# Altium project qav90.PrjPCB
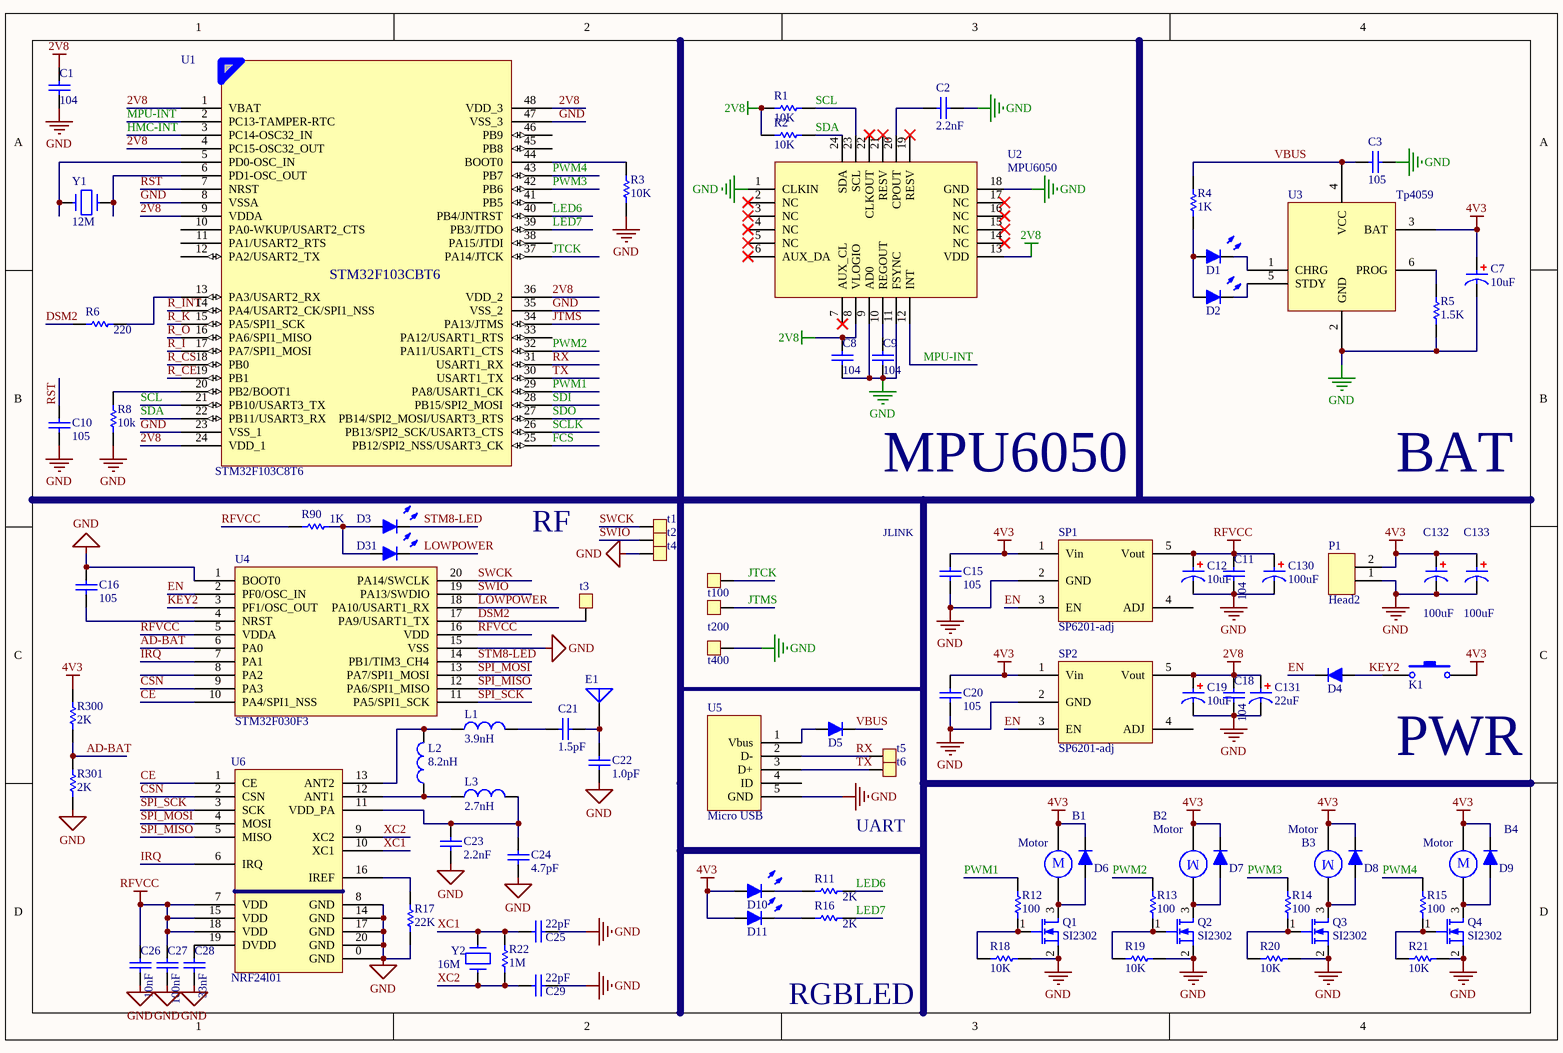
[diagram p0: qav90.SchDoc]
1 sheet, 94 parts. Net scope: global (net labels, ports and power ports of the same name join across sheets).
Board file: qav90.PcbDoc

## Sheet qav90.SchDoc
size A4

### Parts
B1  Motor  [CONN1.27*2]
B2  Motor  [CONN1.27*2]
B3  Motor  [CONN1.27*2]
B4  Motor  [CONN1.27*2]
C1  104  [0603C]
C2  C2.2nF  [0603C]  (value not drawn)
C3  C1uF  [0603C]  (value not drawn)
C7  C10uF  [0603C]  (value not drawn)
C8  104  [0603C]
C9  104  [0603C]
C10  C1uF  [0603C]  (value not drawn)
C11  104  [0603C]
C12  C10uF  [0603C]  (value not drawn)
C15  C1uF  [0603C]  (value not drawn)
C16  C1uF  [0603C]  (value not drawn)
C18  104  [0603C]
C19  C10uF  [0603C]  (value not drawn)
C20  C1uF  [0603C]  (value not drawn)
C21  1.5pF  [0402]
C22  1.0pF  [0402]
C23  2.2nF  [0402]
C24  4.7pF  [0402]
C25  22pF  [0402]
C26  10nF  [0402]
C27  100nF  [0402]
C28  33nF  [0402]
C29  22pF  [0402]
C130  100uF  [1206]
C131  22uF  [0805]
C132  100uF  [1206]
C133  100uF  [1206]
D1  LED-B  [LED]  (value not drawn)
D2  LED-G  [LED]  (value not drawn)
D3  LED-G  [LED]  (value not drawn)
D4  BAT54WS  [LC-SOD-323F]  (value not drawn)
D5  BAT54WS  [LC-SOD-323F]  (value not drawn)
D6  BAT54WS  [LC-SOD-323F]  (value not drawn)
D7  BAT54WS  [LC-SOD-323F]  (value not drawn)
D8  BAT54WS  [LC-SOD-323F]  (value not drawn)
D9  BAT54WS  [LC-SOD-323F]  (value not drawn)
D10  LED-B  [LED]  (value not drawn)
D11  LED-R  [LED]  (value not drawn)
D31  LED-R  [LED]  (value not drawn)
E1  Antenna  [ANT6520]  (value not drawn)
K1  KEY-PB  [KEY_ALPS]  (value not drawn)
L1  3.9nH  [0402]
L2  8.2nH  [0402]
L3  2.7nH  [0402]
P1  Head2  [HEAD2]
Q1  SI2302  [SOT-23-3]
Q2  SI2302  [SOT-23-3]
Q3  SI2302  [SOT-23-3]
Q4  SI2302  [SOT-23-3]
R1  R10K  [0603R]  (value not drawn)
R2  R10K  [0603R]  (value not drawn)
R3  R10K  [0603R]  (value not drawn)
R4  R1K  [0603R]  (value not drawn)
R5  R1.5K  [0603R]  (value not drawn)
R6  R220  [0603R]  (value not drawn)
R8  R10K  [0603R]  (value not drawn)
R11  R2K  [0603R]  (value not drawn)
R12  R100R  [0603R]  (value not drawn)
R13  R100R  [0603R]  (value not drawn)
R14  R100R  [0603R]  (value not drawn)
R15  R100R  [0603R]  (value not drawn)
R16  R2K  [0603R]  (value not drawn)
R17  22K  [0402]
R18  R10K  [0603R]  (value not drawn)
R19  R10K  [0603R]  (value not drawn)
R20  R10K  [0603R]  (value not drawn)
R21  R10K  [0603R]  (value not drawn)
R22  R1M  [0402]  (value not drawn)
R90  R1K  [0603R]  (value not drawn)
R300  R2K  [0603R]  (value not drawn)
R301  R2K  [0603R]  (value not drawn)
SP1  SP6201-adj  [SOT23-5]
SP2  SP6201-adj  [SOT23-5]
t1  TP  [TESTPOINT]  (value not drawn)
t2  TP  [TESTPOINT]  (value not drawn)
t3  TP  [TEST_PAD]  (value not drawn)
t4  TP  [TESTPOINT]  (value not drawn)
t5  TP  [TESTPOINT]  (value not drawn)
t6  TP  [TESTPOINT]  (value not drawn)
t100  TP  [TESTPOINT]  (value not drawn)
t200  TP  [TESTPOINT]  (value not drawn)
t400  TP  [TESTPOINT]  (value not drawn)
U1  STM32F103C8T6  [STM32C8T6]
U2  MPU6050  [QFN24-1]
U3  Tp4059  [LC-SOT-23-6]
U4  STM32F030F3  [TSSOP20]
U5  Micro USB  [Micro_USB_t]
U6  NRF24l01  [QFN20-4X4]
Y1  12M  [XTAL3225]
Y2  16M  [XTAL3225]

### Nets
2V8: C1.2 C8.2 C18.2 C19.1 C131.1 R1.2 R2.2 SP2.5(Vout) U1.1(VBAT) U1.4(PC15-OSC32_OUT) U1.9(VDDA) U1.24(VDD_1) U1.36(VDD_2) U1.48(VDD_3) U2.8(VLOGIO) U2.13(VDD)
4V3: B1.1 B2.2 B3.2 B4.1 C7.1 C15.2 C20.2 C132.1 C133.1 D6.2(K) D7.2(K) D8.2(K) D9.2(K) D10.1(A) D11.1(A) K1.2 P1.2 R300.1 SP1.1(Vin) SP2.1(Vin) U3.3(BAT)
GND: C1.1 C2.2 C3.1 C7.2 C8.1 C9.1 C10.2 C11.1 C12.2 C15.1 C16.1 C18.1 C19.2 C20.1 C22.1 C23.1 C24.1 C25.1 C26.1 C27.1 C28.1 C29.1 C130.2 C131.2 C132.2 C133.2 P1.1 Q1.2(S) Q2.2(S) Q3.2(S) Q4.2(S) R3.2 R5.1 R8.1 R17.2 R18.2 R19.1 R20.1 R21.1 R301.2 SP1.2(GND) SP2.2(GND) t4.1(R) t400.1(R) U1.8(VSSA) U1.23(VSS_1) U1.35(VSS_2) U1.47(VSS_3) U2.1(CLKIN) U2.9(AD0) U2.11(FSYNC) U2.18(GND) U3.2(GND) U4.1(BOOT0) U4.15(VSS) U5.5(GND) U6.0(GND) U6.8(GND) U6.14(GND) U6.17(GND) U6.20(GND)
RFVCC: C11.2 C12.1 C26.2 C27.2 C130.1 R90.1 SP1.5(Vout) U4.5(VDDA) U4.16(VDD) U6.7(VDD) U6.15(VDD) U6.18(VDD)
AD-BAT: R300.2 R301.1 U4.6(PA0)
CE: U4.10(PA4/SPI1_NSS) U6.1(CE)
CSN: U4.9(PA3) U6.2(CSN)
DSM2: R6.1 t3.1(R) U4.17(PA9/USART1_TX)
EN: D4.2(K) SP1.3(EN) SP2.3(EN) U4.2(PF0/OSC_IN)
FCS: U1.25(PB12/SPI2_NSS/USART3_CK)
HMC-INT: U1.3(PC14-OSC32_IN)
IRQ: U4.7(PA1) U6.6(IRQ)
JTCK: t100.1(R) U1.37(PA14/JTCK)
JTMS: t200.1(R) U1.34(PA13/JTMS)
KEY2: D4.1(A) K1.1 U4.3(PF1/OSC_OUT)
LED6: R11.2 U1.40(PB4/JNTRST)
LED7: R16.2 U1.39(PB3/JTDO)
LOWPOWER: D31.2(K) U4.18(PA10/USART1_RX)
MPU-INT: U1.2(PC13-TAMPER-RTC) U2.12(INT)
PWM1: R12.2 U1.29(PA8/USART1_CK)
PWM2: R13.2 U1.32(PA11/USART1_CTS)
PWM3: R14.2 U1.42(PB6)
PWM4: R15.2 U1.43(PB7)
R_CE: U1.19(PB1)
R_CS: U1.18(PB0)
R_I: U1.17(PA7/SPI1_MOSI)
R_INT: U1.14(PA4/USART2_CK/SPI1_NSS)
R_K: U1.15(PA5/SPI1_SCK)
R_O: U1.16(PA6/SPI1_MISO)
RST: C10.1 U1.7(NRST)
RX: t5.1(R) U1.31(USART1_RX) U5.2(D-)
SCL: R1.1 U1.21(PB10/USART3_TX) U2.23(SCL)
SCLK: U1.26(PB13/SPI2_SCK/USART3_CTS)
SDA: R2.1 U1.22(PB11/USART3_RX) U2.24(SDA)
SDI: U1.28(PB15/SPI2_MOSI)
SDO: U1.27(PB14/SPI2_MOSI/USART3_RTS)
SPI_MISO: U4.12(PA6/SPI1_MISO) U6.5(MISO)
SPI_MOSI: U4.13(PA7/SPI1_MOSI) U6.4(MOSI)
SPI_SCK: U4.11(PA5/SPI1_SCK) U6.3(SCK)
STM8-LED: D3.2(K) U4.14(PB1/TIM3_CH4)
SWCK: t1.1(R) U4.20(PA14/SWCLK)
SWIO: t2.1(R) U4.19(PA13/SWDIO)
TX: t6.1(R) U1.30(USART1_TX) U5.3(D+)
VBUS: C3.2 D5.2(K) R4.2 U3.4(VCC)
XC1: C25.2 R22.1 U6.10(XC1) Y2.3
XC2: C29.2 R22.2 U6.9(XC2) Y2.1
NetB1_2: B1.2 D6.1(A) Q1.3(D)
NetB2_1: B2.1 D7.1(A) Q2.3(D)
NetB3_1: B3.1 D8.1(A) Q3.3(D)
NetB4_2: B4.2 D9.1(A) Q4.3(D)
NetC2_1: C2.1 U2.20(CPOUT)
NetC9_2: C9.2 U2.10(REGOUT)
NetC16_2: C16.2 U4.4(NRST)
NetC21_1: C21.1 L1.2
NetC21_2: C21.2 C22.2 E1.1(A)
NetC23_2: C23.2 C24.2 L3.1 U6.11(VDD_PA)
NetC28_2: C28.2 U6.19(DVDD)
NetD1_1: D1.1(A) D2.1(A) R4.1
NetD1_2: D1.2(K) U3.1(CHRG)
NetD2_2: D2.2(K) U3.5(STDY)
NetD3_1: D3.1(A) D31.1(A) R90.2
NetD5_1: D5.1(A) U5.1(Vbus)
NetD10_2: D10.2(K) R11.1
NetD11_2: D11.2(K) R16.1
NetL1_1: L1.1 L2.2 U6.13(ANT2)
NetL2_1: L2.1 L3.2 U6.12(ANT1)
NetQ1_1: Q1.1(G) R12.1 R18.1
NetQ2_1: Q2.1(G) R13.1 R19.2
NetQ3_1: Q3.1(G) R14.1 R20.2
NetQ4_1: Q4.1(G) R15.1 R21.2
NetR3_1: R3.1 U1.44(BOOT0)
NetR5_2: R5.2 U3.6(PROG)
NetR6_2: R6.2 U1.13(PA3/USART2_RX)
NetR8_2: R8.2 U1.20(PB2/BOOT1)
NetR17_1: R17.1 U6.16(IREF)
NetU1_5: U1.5(PD0-OSC_IN) Y1.1
NetU1_6: U1.6(PD1-OSC_OUT) Y1.3

Not connected (* = marked no-connect by the designer): SP1 4(ADJ); SP2 4(ADJ); U1 10(PA0-WKUP/USART2_CTS) 11(PA1/USART2_RTS) 12(PA2/USART2_TX) 33(PA12/USART1_RTS) 38(PA15/JTDI) 41(PB5) 45(PB8) 46(PB9); U2 2(NC)* 3(NC)* 4(NC)* 5(NC)* 6(AUX_DA)* 7(AUX_CL)* 14(NC)* 15(NC)* 16(NC)* 17(NC)* 19(RESV)* 21(RESV)* 22(CLKOUT)*; U4 8(PA2); U5 0(SHELL) 4(ID)

### Notes on the sheet
- MPU6050
- BAT
- RF
- (near C15) JLINK
- (near K1) PWR
- UART
- RGBLED
- (in symbol C0.1uF) 105; 2.2nF
- (in symbol C10uF) 10uF
- (in symbol Motor) M
- (in symbol R1K) 2K; 1K; 1.5K
- (in symbol R10K) 220; 10k; 10K; 1M; 2K
- (in symbol R100R) 100
- (in symbol STM32F103C8T6) STM32F103CBT6

### Library data of the parts
B1-B4 = Motor: Motor, General Kind; Published: 24-Mar-1999; LatestRevisionDate: 17-Jul-2002; LatestRevisionNote: Re-released for DXP Platform.; PackageReference: RB5-10.5; Publisher: Altium Limited; PackageDescription: Capacitor (Radial); 2 Leads
C1-C3 C8-C11 C15 C16 C18 C20-C29 = C0.1uF
C130-C133 = C100uF
D1-D3 D10 D11 D31 = LED
D4-D9 = Diode
E1 = Antenna: Generic Antenna; Published: 24-Mar-1999; LatestRevisionDate: 17-Jul-2002; LatestRevisionNote: Re-released for DXP Platform.; PackageReference: PIN1; Publisher: Altium Limited
L1-L3 = Inductor-100uH
Q1-Q4 = MOSFET-N
R5 R11 R16 = R1K
R6 R17 R22 R300 R301 = R10K
SP1 SP2 = SP6201
U4 = STM32F030F4
U5 = MINI USB
Y1 Y2 = CRYSTAL